# Altium schematic sheet PowerClocks.SCHDOC
size B
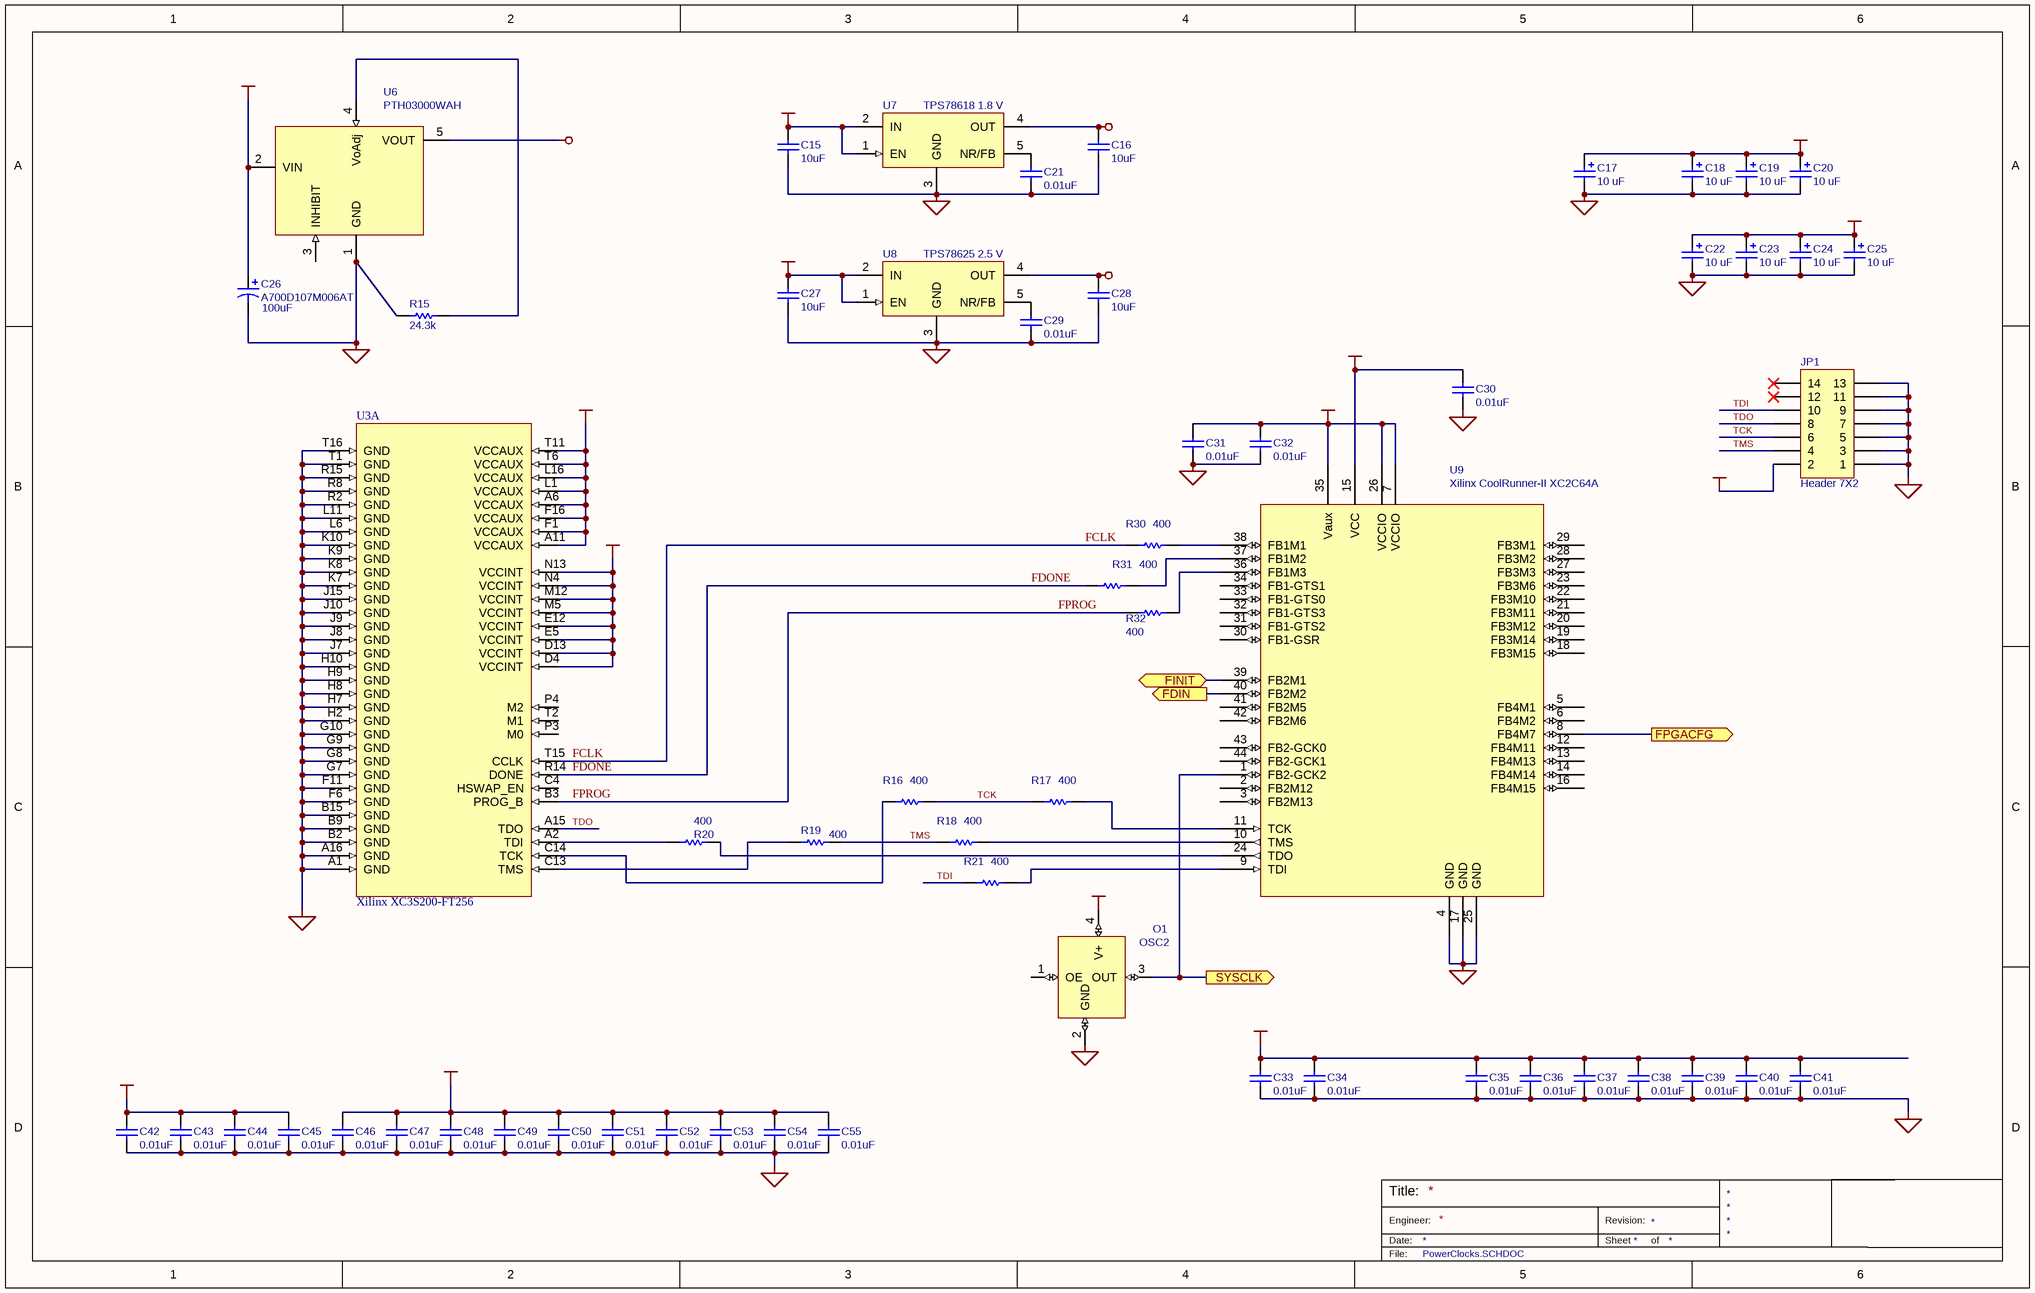
[diagram p0: PowerClocks.SCHDOC]

## Parts
C15  10uF  [CC3216-1206]
C16  10uF  [CC3216-1206]
C17  value 10 uF  [TC3528-1411]  (hidden comment: Bypass Cap)
C18  value 10 uF  [TC3528-1411]  (hidden comment: Bypass Cap)
C19  value 10 uF  [TC3528-1411]  (hidden comment: Bypass Cap)
C20  value 10 uF  [TC3528-1411]  (hidden comment: Bypass Cap)
C21  value 0.01uF  [CC1005-0402]  (hidden comment: Cap)
C22  value 10 uF  [TC3528-1411]  (hidden comment: Bypass Cap)
C23  value 10 uF  [TC3528-1411]  (hidden comment: Bypass Cap)
C24  value 10 uF  [TC3528-1411]  (hidden comment: Bypass Cap)
C25  value 10 uF  [TC3528-1411]  (hidden comment: Bypass Cap)
C26  A700D107M006AT  value 100uF  [TC7343-2917]
C27  10uF  [CC3216-1206]
C28  10uF  [CC3216-1206]
C29  value 0.01uF  [CC1005-0402]  (hidden comment: Cap)
C30  value 0.01uF  [CC1005-0402]  (hidden comment: Cap)
C31  value 0.01uF  [CC1005-0402]  (hidden comment: Cap)
C32  value 0.01uF  [CC1005-0402]  (hidden comment: Cap)
C33  value 0.01uF  [CC1005-0402]  (hidden comment: Cap)
C34  value 0.01uF  [CC1005-0402]  (hidden comment: Cap)
C35  value 0.01uF  [CC1005-0402]  (hidden comment: Cap)
C36  value 0.01uF  [CC1005-0402]  (hidden comment: Cap)
C37  value 0.01uF  [CC1005-0402]  (hidden comment: Cap)
C38  value 0.01uF  [CC1005-0402]  (hidden comment: Cap)
C39  value 0.01uF  [CC1005-0402]  (hidden comment: Cap)
C40  value 0.01uF  [CC1005-0402]  (hidden comment: Cap)
C41  value 0.01uF  [CC1005-0402]  (hidden comment: Cap)
C42  value 0.01uF  [CC1005-0402]  (hidden comment: Cap)
C43  value 0.01uF  [CC1005-0402]  (hidden comment: Cap)
C44  value 0.01uF  [CC1005-0402]  (hidden comment: Cap)
C45  value 0.01uF  [CC1005-0402]  (hidden comment: Cap)
C46  value 0.01uF  [CC1005-0402]  (hidden comment: Cap)
C47  value 0.01uF  [CC1005-0402]  (hidden comment: Cap)
C48  value 0.01uF  [CC1005-0402]  (hidden comment: Cap)
C49  value 0.01uF  [CC1005-0402]  (hidden comment: Cap)
C50  value 0.01uF  [CC1005-0402]  (hidden comment: Cap)
C51  value 0.01uF  [CC1005-0402]  (hidden comment: Cap)
C52  value 0.01uF  [CC1005-0402]  (hidden comment: Cap)
C53  value 0.01uF  [CC1005-0402]  (hidden comment: Cap)
C54  value 0.01uF  [CC1005-0402]  (hidden comment: Cap)
C55  value 0.01uF  [CC1005-0402]  (hidden comment: Cap)
JP1  Header 7X2  [HDR2x7-2mm]
O1  OSC2  [ECS-3953M]
R15  value 24.3k  [CR3216-1206]  (hidden comment: Res1)
R16  value 400  [CR1608-0603]  (hidden comment: current-limiting series res)
R17  value 400  [CR1608-0603]  (hidden comment: current-limiting series res)
R18  value 400  [CR1608-0603]  (hidden comment: current-limiting series res)
R19  value 400  [CR1608-0603]  (hidden comment: current-limiting series res)
R20  value 400  [CR1608-0603]  (hidden comment: current-limiting series res)
R21  value 400  [CR1608-0603]  (hidden comment: current-limiting series res)
R30  value 400  [CR1608-0603]  (hidden comment: current-limiting series res)
R31  value 400  [CR1608-0603]  (hidden comment: current-limiting series res)
R32  value 400  [CR1608-0603]  (hidden comment: current-limiting series res)
U3  Xilinx XC3S200-FT256  [Xilinx FT256 BGA]  (part A of 9)
U6  PTH03000WAH  [TI EUS]
U7  TPS78618 1.8 V  [KTT]
U8  TPS78625 2.5 V  [KTT]
U9  Xilinx CoolRunner-II XC2C64A  [QFP10x10-G44/G10N]

## Ports
FDIN (out), FINIT (bidir), FPGACFG (out), SYSCLK (out)

## Nets
+1.2VCC: C22.1 C23.1 C24.1 C25.1 C42.2 C43.2 C44.2 C45.2 U3.D4(VCCINT) U3.D13(VCCINT) U3.E5(VCCINT) U3.E12(VCCINT) U3.M5(VCCINT) U3.M12(VCCINT) U3.N4(VCCINT) U3.N13(VCCINT) U6.5(VOUT)
+1.8VCC: C16.2 C30.2 U7.4(OUT) U9.15(VCC)
+2.5VCC: C28.2 C46.2 C47.2 C48.2 C49.2 C50.2 C51.2 C52.2 C53.2 C54.2 C55.2 U3.A6(VCCAUX) U3.A11(VCCAUX) U3.F1(VCCAUX) U3.F16(VCCAUX) U3.L1(VCCAUX) U3.L16(VCCAUX) U3.T6(VCCAUX) U3.T11(VCCAUX) U8.4(OUT)
GND: C15.1 C16.1 C17.2 C18.2 C19.2 C20.2 C21.2 C22.2 C23.2 C24.2 C25.2 C26.2 C27.1 C28.1 C29.2 C30.1 C31.1 C32.1 C33.1 C34.1 C35.1 C36.1 C37.1 C38.1 C39.1 C40.1 C41.1 C42.1 C43.1 C44.1 C45.1 C46.1 C47.1 C48.1 C49.1 C50.1 C51.1 C52.1 C53.1 C54.1 C55.1 JP1.1 JP1.3 JP1.5 JP1.7 JP1.9 JP1.11 JP1.13 O1.2(GND) R15.2 U3.A1(GND) U3.A16(GND) U3.B2(GND) U3.B9(GND) U3.B15(GND) U3.F6(GND) U3.F11(GND) U3.G7(GND) U3.G8(GND) U3.G9(GND) U3.G10(GND) U3.H2(GND) U3.H7(GND) U3.H8(GND) U3.H9(GND) U3.H10(GND) U3.J7(GND) U3.J8(GND) U3.J9(GND) U3.J10(GND) U3.J15(GND) U3.K7(GND) U3.K8(GND) U3.K9(GND) U3.K10(GND) U3.L6(GND) U3.L11(GND) U3.R2(GND) U3.R8(GND) U3.R15(GND) U3.T1(GND) U3.T16(GND) U6.1(GND) U7.3(GND) U8.3(GND) U9.4(GND) U9.17(GND) U9.25(GND)
VCC: C15.2 C17.1 C18.1 C19.1 C20.1 C26.1 C27.2 C31.2 C32.2 C33.2 C34.2 C35.2 C36.2 C37.2 C38.2 C39.2 C40.2 C41.2 JP1.2 O1.4(V+) U6.2(VIN) U7.1(EN) U7.2(IN) U8.1(EN) U8.2(IN) U9.7(VCCIO) U9.26(VCCIO) U9.35(Vaux)
FCLK: R30.2 U3.T15(CCLK)
FDIN: U9.40(FB2M2) ; port FDIN
FDONE: R31.2 U3.R14(DONE)
FINIT: U9.39(FB2M1) ; port FINIT
FPGACFG: U9.8(FB4M7) ; port FPGACFG
FPROG: R32.2 U3.B3(PROG_B)
SYSCLK: O1.3(OUT) U9.1(FB2-GCK2) ; port SYSCLK
TCK: JP1.6 R16.1 R17.2
TDI: JP1.10 R21.2
TDO: JP1.8 U3.A15(TDO)
TMS: JP1.4 R18.2 R19.2
NetC21_1: C21.1 U7.5(NR/FB)
NetC29_1: C29.1 U8.5(NR/FB)
NetR15_1: R15.1 U6.4(VoAdj)
NetR16_2: R16.2 U3.C14(TCK)
NetR17_1: R17.1 U9.11(TCK)
NetR18_1: R18.1 U9.10(TMS)
NetR19_1: R19.1 U3.C13(TMS)
NetR20_1: R20.1 U9.24(TDO)
NetR20_2: R20.2 U3.A2(TDI)
NetR21_1: R21.1 U9.9(TDI)
NetR30_1: R30.1 U9.38(FB1M1)
NetR31_1: R31.1 U9.37(FB1M2)
NetR32_1: R32.1 U9.36(FB1M3)

Not connected (* = marked no-connect by the designer): JP1 12* 14*; O1 1(OE); U3 C4(HSWAP_EN) P3(M0) P4(M2) T2(M1); U6 3(INHIBIT); U9 2(FB2M12) 3(FB2M13) 5(FB4M1) 6(FB4M2) 12(FB4M11) 13(FB4M13) 14(FB4M14) 16(FB4M15) 18(FB3M15) 19(FB3M14) 20(FB3M12) 21(FB3M11) 22(FB3M10) 23(FB3M6) 27(FB3M3) 28(FB3M2) 29(FB3M1) 30(FB1-GSR) 31(FB1-GTS2) 32(FB1-GTS3) 33(FB1-GTS0) 34(FB1-GTS1) 41(FB2M5) 42(FB2M6) 43(FB2-GCK0) 44(FB2-GCK1)

## Notes on the sheet
- Title:
- Engineer:
- Date:
- Revision:
- Sheet
- of
- File:

## Library data of the parts
C15 C16 C21 C27-C29 = Cap: Capacitor; Published: 8-Jun-2000; LatestRevisionDate: 17-Jul-2002; LatestRevisionNote: Re-released for DXP Platform.; Publisher: Altium Limited
C17-C20 C22-C25 = Cap Pol3: Tantalum Bypass cap; Manufacturer: Generic Components; Class I: Passive; Class II: Capacitor; Published: 8-Jun-2000; Revision: July-2002: Re-released for DXP Platform.; Publisher: Altium Limited
C26 = Cap Pol1: Polarized Capacitor (Radial); Published: 8-Jun-2000; LatestRevisionDate: 17-Jul-2002; LatestRevisionNote: Re-released for DXP Platform.; Publisher: Altium Limited
C30-C55 = Cap: Capacitor; Manufacturer: Generic Components; Class I: Passive; Published: 8-Jun-2000; Revision: July-2002: Re-released for DXP Platform.; Publisher: Altium Limited; Class II: Capacitor
JP1 = Header 7X2: Header, 7-Pin, Dual row; Manufacturer: Generic Components; Class I: Connector; Vendor: MOLEX 87831-1420; Revision: July-2002: Re-released for DXP Platform.; Publisher: Altium Limited
O1 = OSC2: ECS SMD Oscillator, ECS-3953M
R15 = Res1: Resistor; Published: 8-Jun-2000; LatestRevisionDate: 17-Jul-2002; LatestRevisionNote: Re-released for DXP Platform.; Publisher: Altium Limited
R16-R21 R30-R32 = Res1: Resistor; Manufacturer: Generic Components; Class I: Passive; Published: 8-Jun-2000; Revision: July-2002: Re-released for DXP Platform.; Publisher: Altium Limited; Class II: Resistor
U3 = XC3S200-FT256: Xilinx Spartan-3 FPGA
U6 = PTH03000
U7 U8 = TPS786XX: TI 1.5A LDO
U9 = XC2C64A-5VQ44C